# EAGLE design SNAC  7ch SMS DB9 3D in Housing with JST (EAGLE 9.0.1)
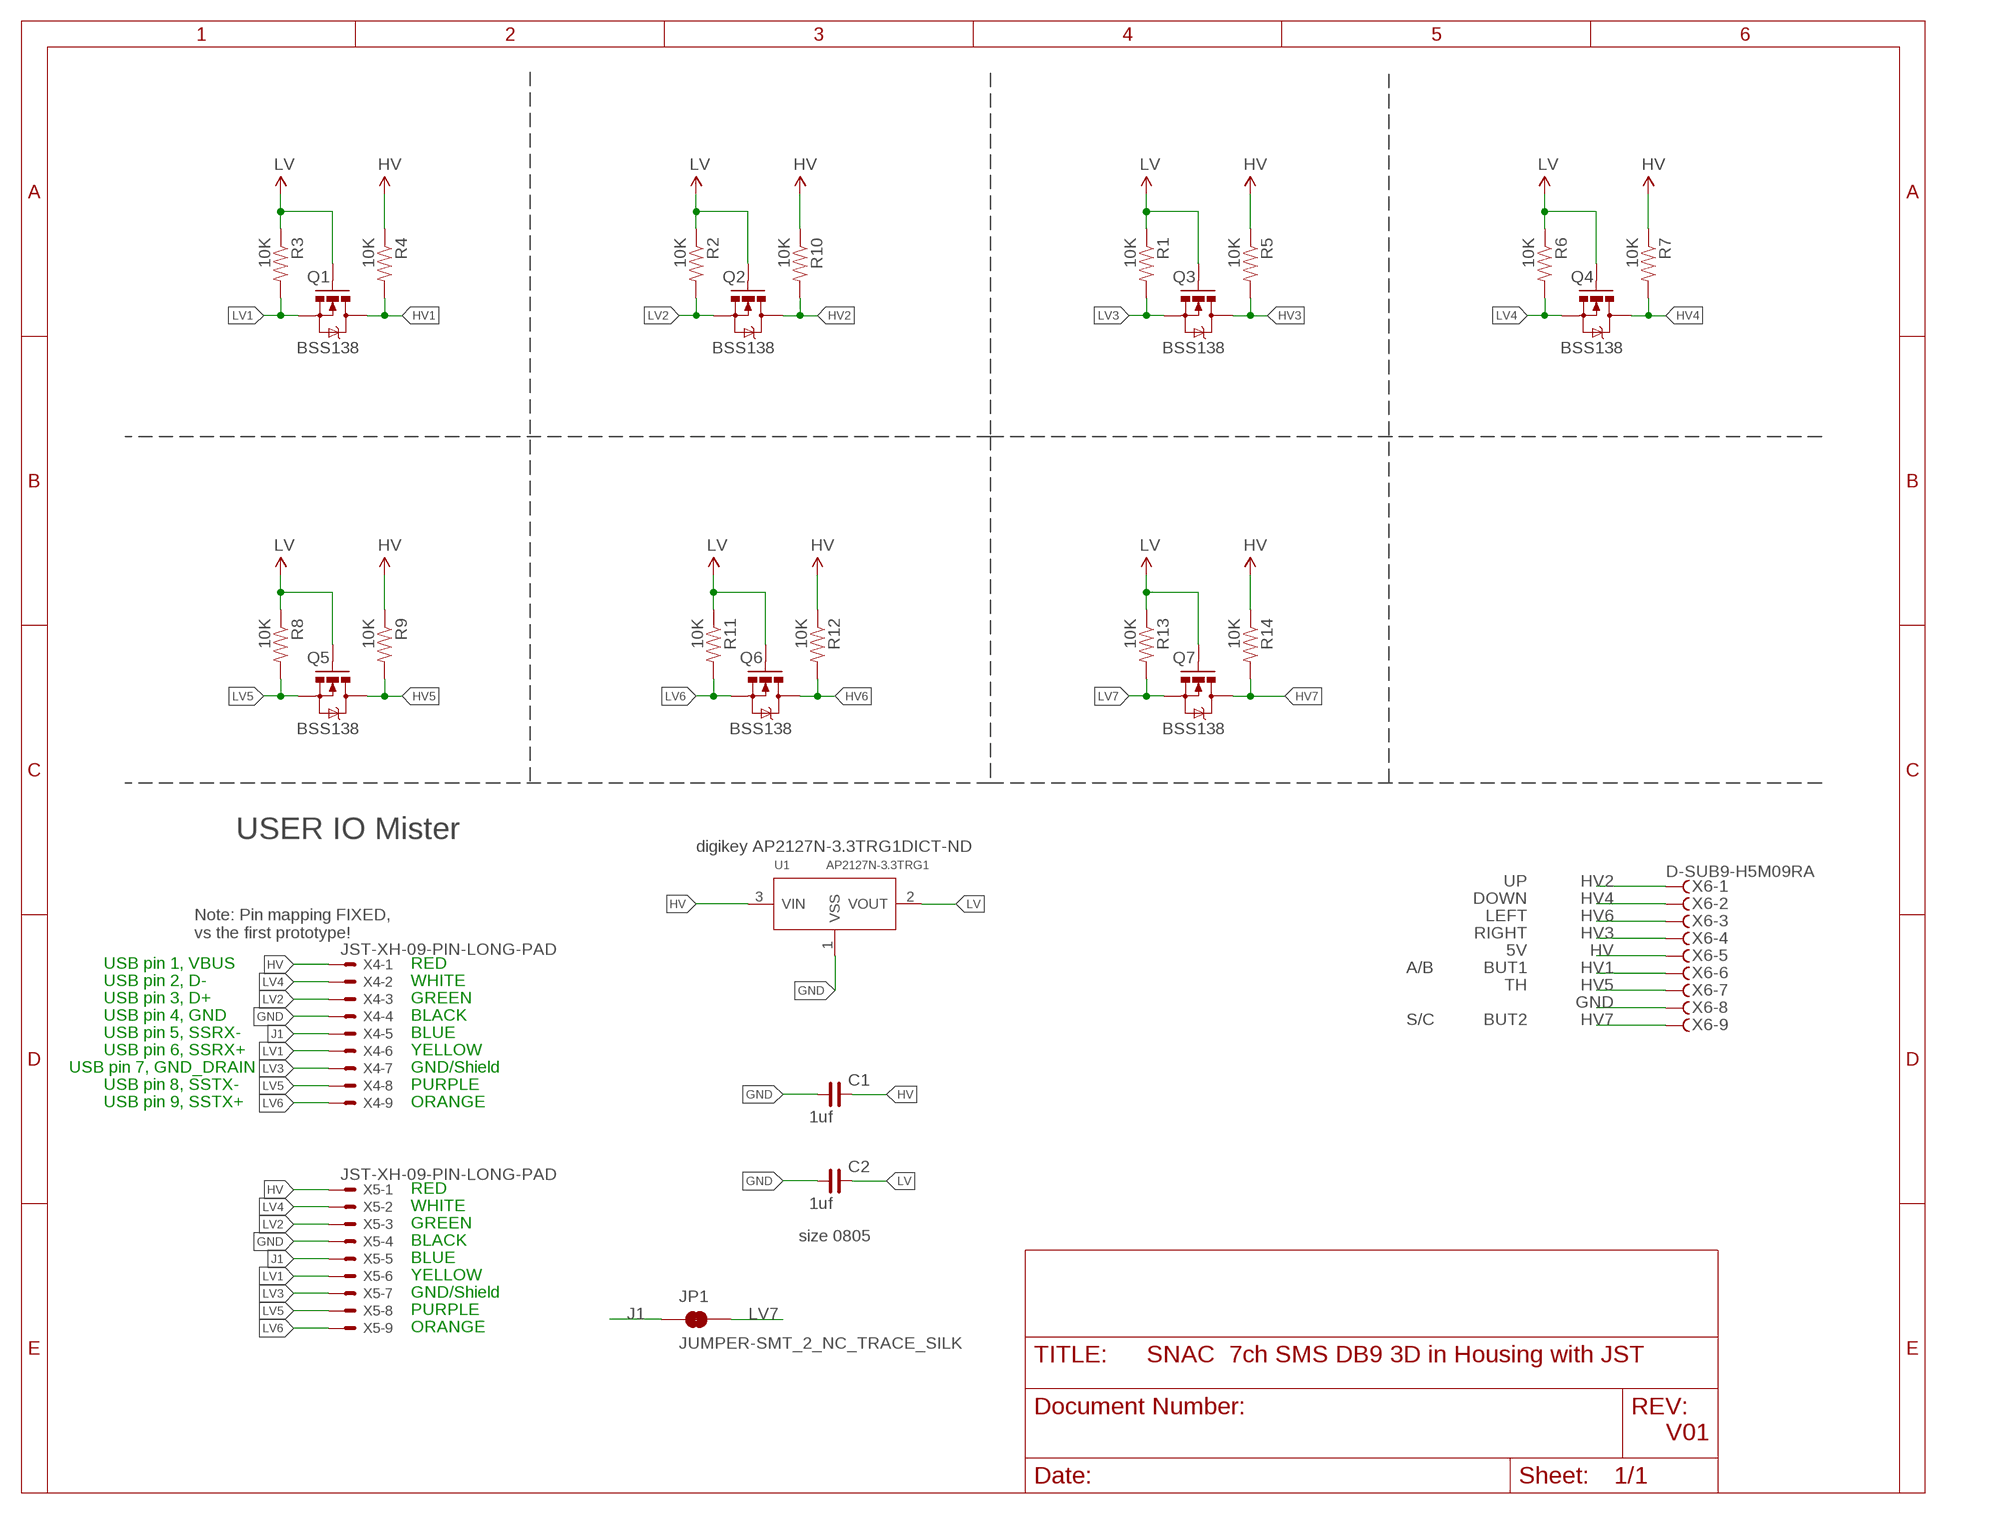
[diagram p0: schematic, sheet 1, part 1 of 2]
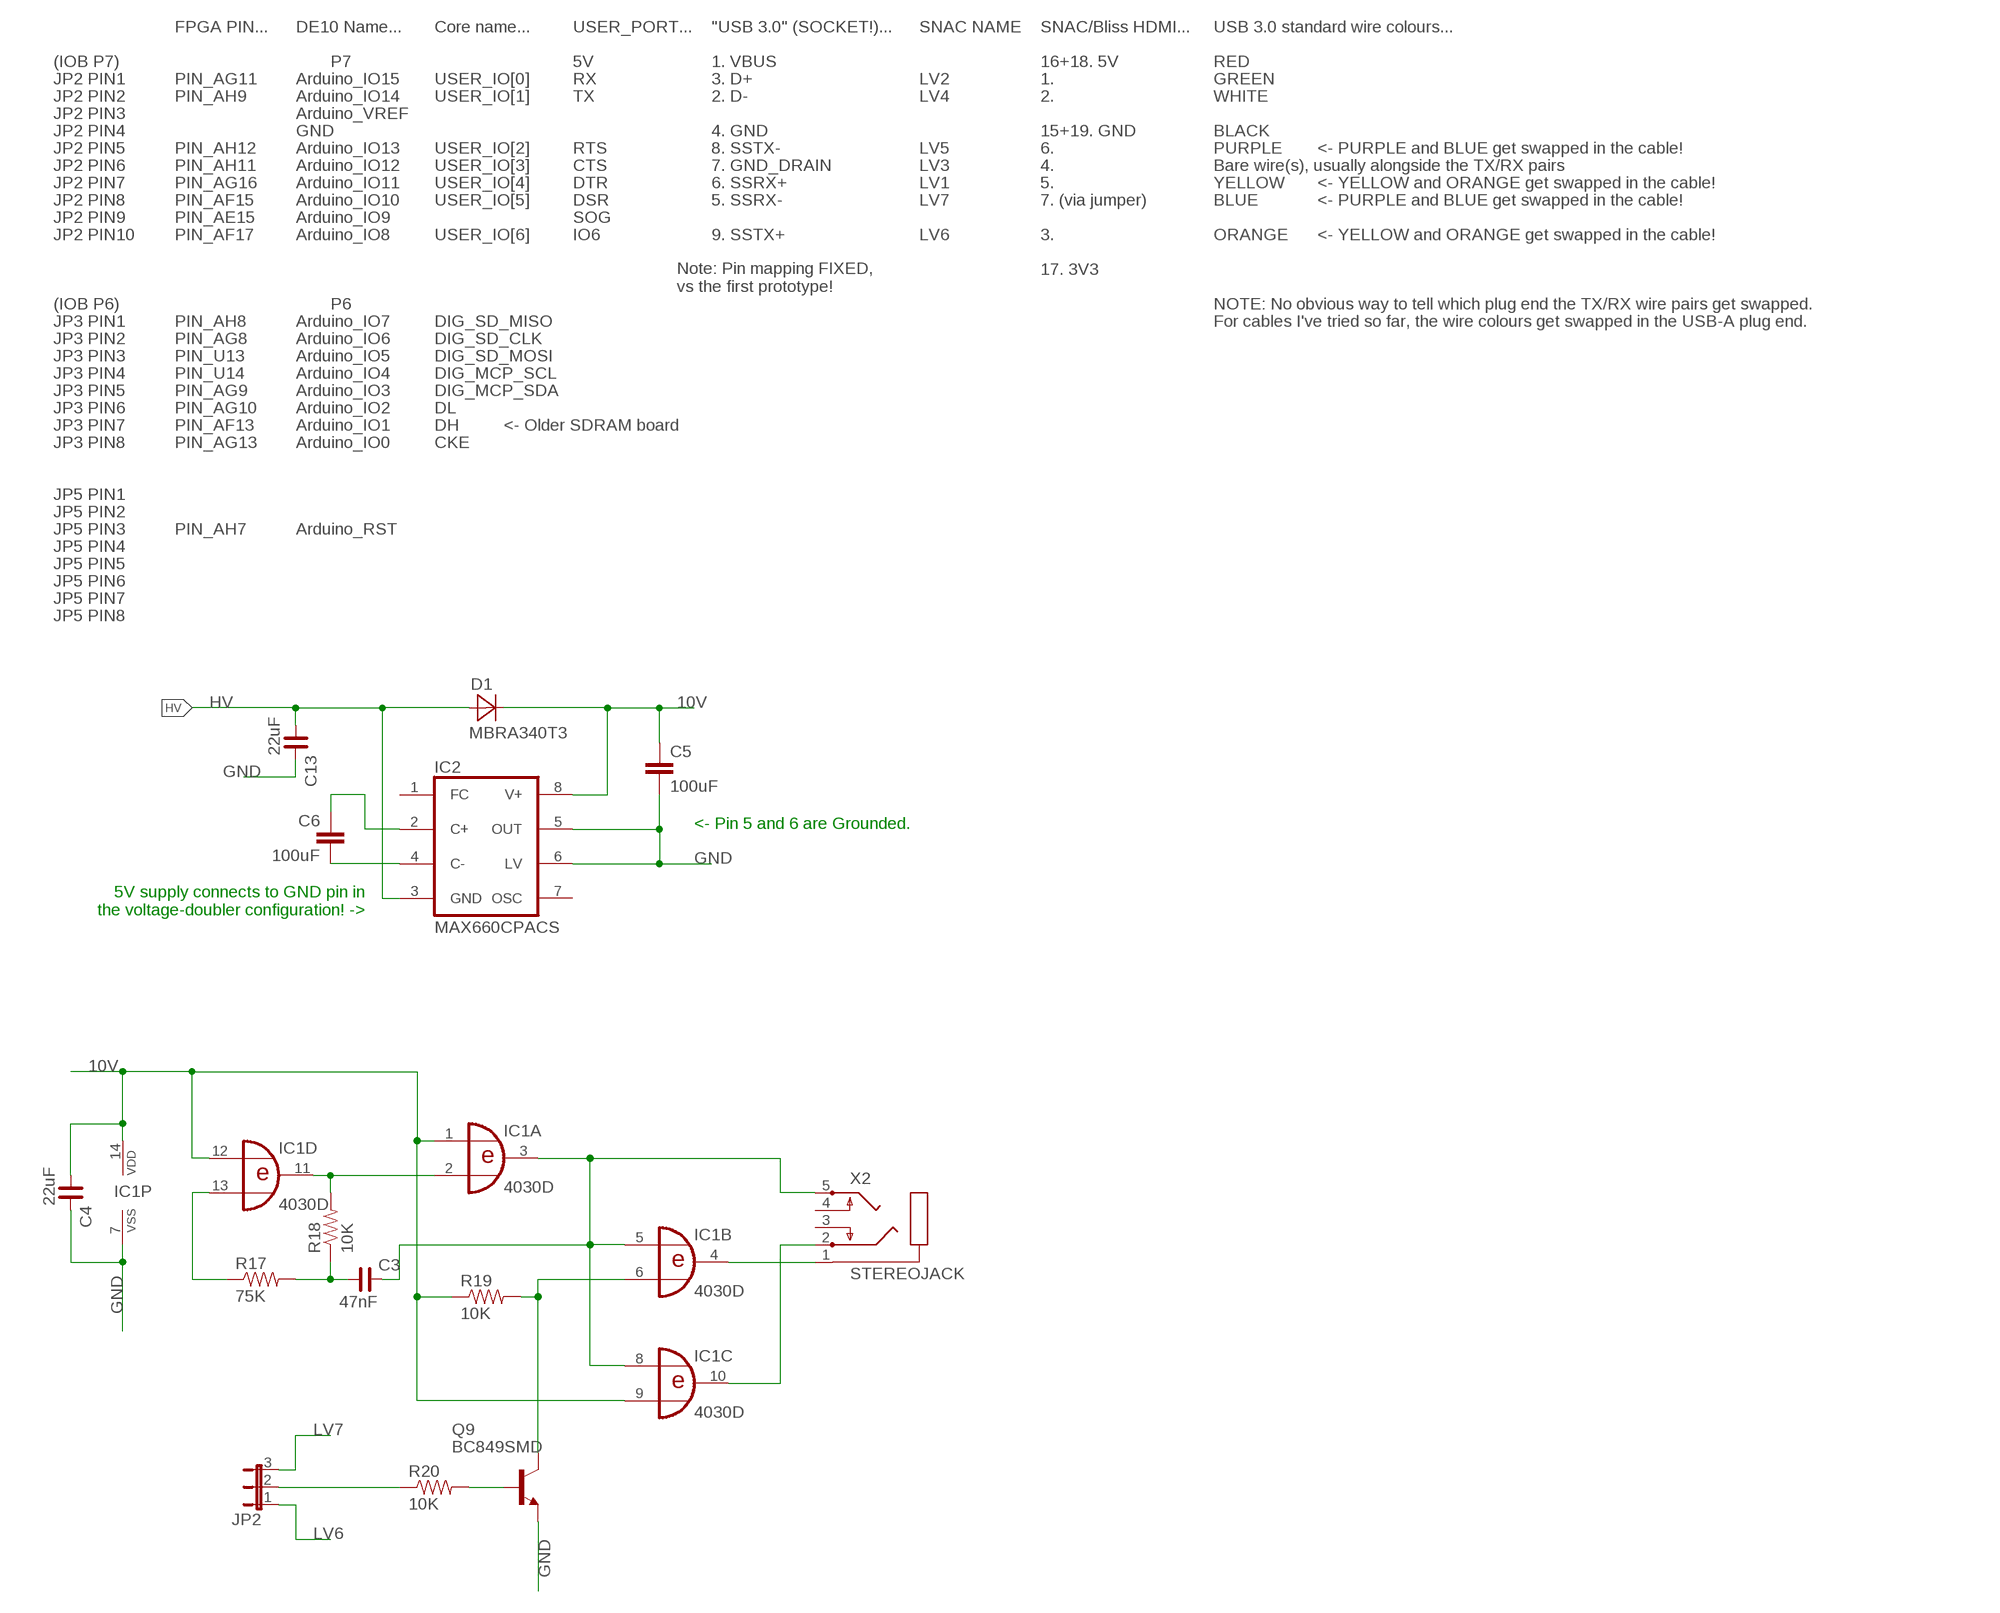
[diagram p1: schematic, sheet 1, part 2 of 2]

## Parts
C1  1uf  C_0805  [C0805]
C2  1uf  C_0805  [C0805]
C3  47nF  C_0805  [C0805]
C4  22uF  C_0805  [C0805]
C5  100uF  C-EUC1812  [C1812]
C6  100uF  C-EUC1812  [C1812]
C13  22uF  C_0805  [C0805]
D1  MBRA340T3  [SMA]
IC1  4030D  [SO14]
IC2  MAX660CPACS  [SO08]
JP1  JUMPER-SMT_2_NC_TRACE_SILK  [SMT-JUMPER_2_NC_TRACE_SILK]
JP2  JP2E  [JP2]
Q1  BSS138  MOSFET-NCHANNELSMD  [SOT23-3]
Q2  BSS138  MOSFET-NCHANNELSMD  [SOT23-3]
Q3  BSS138  MOSFET-NCHANNELSMD  [SOT23-3]
Q4  BSS138  MOSFET-NCHANNELSMD  [SOT23-3]
Q5  BSS138  MOSFET-NCHANNELSMD  [SOT23-3]
Q6  BSS138  MOSFET-NCHANNELSMD  [SOT23-3]
Q7  BSS138  MOSFET-NCHANNELSMD  [SOT23-3]
Q9  BC849SMD  [SOT23-BEC]
R1  10K  RESISTOR0603-RES  [0603-RES]
R2  10K  RESISTOR0603-RES  [0603-RES]
R3  10K  RESISTOR0603-RES  [0603-RES]
R4  10K  RESISTOR0603-RES  [0603-RES]
R5  10K  RESISTOR0603-RES  [0603-RES]
R6  10K  RESISTOR0603-RES  [0603-RES]
R7  10K  RESISTOR0603-RES  [0603-RES]
R8  10K  RESISTOR0603-RES  [0603-RES]
R9  10K  RESISTOR0603-RES  [0603-RES]
R10  10K  RESISTOR0603-RES  [0603-RES]
R11  10K  RESISTOR0603-RES  [0603-RES]
R12  10K  RESISTOR0603-RES  [0603-RES]
R13  10K  RESISTOR0603-RES  [0603-RES]
R14  10K  RESISTOR0603-RES  [0603-RES]
R17  75K  RESISTOR0603-RES  [0603-RES]
R18  10K  RESISTOR0603-RES  [0603-RES]
R19  10K  RESISTOR0603-RES  [0603-RES]
R20  10K  RESISTOR0603-RES  [0603-RES]
U1  AP2127N-3.3TRG1  PMIC-LDO-XC6206P332MR-G(SOT23)  [SOT-23]
X2  STEREOJACK  [STX3100]
X4  JST-XH-09-PIN-LONG-PAD  [JST-XH-09-PACKAGE-LONG-PAD]
X5  JST-XH-09-PIN-LONG-PAD  [JST-XH-09-PACKAGE-LONG-PAD]
X6  D-SUB9-H5M09RA  [H5M09RA]

## Nets
10V: C4.1 C5.1 D1.C IC1.1(A:I0) IC1.9(C:I1) IC1.12(D:I0) IC1.14(P:VDD) IC2.8(V+) R19.1
GND: C1.1 C2.1 C4.2 C5.2 C13.2 IC1.7(P:VSS) IC2.5(OUT) IC2.6(LV) Q9.E U1.1(VSS) X4.4 X5.4 X6.8
HV: C1.2 C13.1 D1.A IC2.3(GND) R4.1 R5.1 R7.1 R9.1 R10.1 R12.1 R14.1 U1.3(VIN) X4.1 X5.1 X6.5
HV1: Q1.3(D) R4.2 X6.6
HV2: Q2.3(D) R10.2 X6.1
HV3: Q3.3(D) R5.2 X6.4
HV4: Q4.3(D) R7.2 X6.2
HV5: Q5.3(D) R9.2 X6.7
HV6: Q6.3(D) R12.2 X6.3
HV7: Q7.3(D) R14.2 X6.9
J1: JP1.1 X4.5 X5.5
LV: C2.2 Q1.1(G) Q2.1(G) Q3.1(G) Q4.1(G) Q5.1(G) Q6.1(G) Q7.1(G) R1.1 R2.1 R3.1 R6.1 R8.1 R11.1 R13.1 U1.2(VOUT)
LV1: Q1.2(S) R3.2 X4.6 X5.6
LV2: Q2.2(S) R2.2 X4.3 X5.3
LV3: Q3.2(S) R1.2 X4.7 X5.7
LV4: Q4.2(S) R6.2 X4.2 X5.2
LV5: Q5.2(S) R8.2 X4.8 X5.8
LV6: JP2.1 Q6.2(S) R11.2 X4.9 X5.9
LV7: JP1.2 JP2.3 Q7.2(S) R13.2
N$5: IC1.2(A:I1) IC1.11(D:O) R18.2
N$6: C3.2 IC1.3(A:O) IC1.5(B:I0) IC1.8(C:I0) X2.5
N$7: IC1.4(B:O) X2.1
N$8: IC1.10(C:O) X2.2
N$9: IC1.13(D:I1) R17.1
N$10: C6.1 IC2.2(C+)
N$13: IC1.6(B:I1) Q9.C R19.2
N$14: Q9.B R20.2
N$23: C6.2 IC2.4(C-)
N$24: C3.1 R17.2 R18.1
N$27: JP2.2 R20.1
Unconnected: IC2.1(FC) IC2.7(OSC) X2.3 X2.4

## Notes on the sheet
- FPGA PIN... | DE10 Name... | Core name... | USER_PORT... | "USB 3.0" (SOCKET!)... | SNAC NAME | SNAC/Bliss HDMI... | USB 3.0 standard wire colours...
- (IOB P7) | P7 | 5V | 1. VBUS | 16+18. 5V | RED
- JP2 PIN1 | PIN_AG11 | Arduino_IO15 | USER_IO[0] | RX | 3. D+ | LV2 | 1. | GREEN
- JP2 PIN2 | PIN_AH9 | Arduino_IO14 | USER_IO[1] | TX | 2. D- | LV4 | 2. | WHITE
- JP2 PIN3 | Arduino_VREF
- JP2 PIN4 | GND | 4. GND | 15+19. GND | BLACK
- JP2 PIN5 | PIN_AH12 | Arduino_IO13 | USER_IO[2] | RTS | 8. SSTX- | LV5 | 6. | PURPLE | <- PURPLE and BLUE get swapped in the cable!
- JP2 PIN6 | PIN_AH11 | Arduino_IO12 | USER_IO[3] | CTS | 7. GND_DRAIN | LV3 | 4. | Bare wire(s), usually alongside the TX/RX pairs
- JP2 PIN7 | PIN_AG16 | Arduino_IO11 | USER_IO[4] | DTR | 6. SSRX+ | LV1 | 5. | YELLOW | <- YELLOW and ORANGE get swapped in the cable!
- JP2 PIN8 | PIN_AF15 | Arduino_IO10 | USER_IO[5] | DSR | 5. SSRX- | LV7 | 7. (via jumper) | BLUE | <- PURPLE and BLUE get swapped in the cable!
- JP2 PIN9 | PIN_AE15 | Arduino_IO9 | SOG
- JP2 PIN10 | PIN_AF17 | Arduino_IO8 | USER_IO[6] | IO6 | 9. SSTX+ | LV6 | 3. | ORANGE | <- YELLOW and ORANGE get swapped in the cable!
- 17. 3V3
- Note: Pin mapping FIXED,
  vs the first prototype!
- (IOB P6) | P6 | NOTE: No obvious way to tell which plug end the TX/RX wire pairs get swapped.
- JP3 PIN1 | PIN_AH8 | Arduino_IO7 | DIG_SD_MISO | For cables I've tried so far, the wire colours get swapped in the USB-A plug end.
- JP3 PIN2 | PIN_AG8 | Arduino_IO6 | DIG_SD_CLK
- JP3 PIN3 | PIN_U13 | Arduino_IO5 | DIG_SD_MOSI
- JP3 PIN4 | PIN_U14 | Arduino_IO4 | DIG_MCP_SCL
- JP3 PIN5 | PIN_AG9 | Arduino_IO3 | DIG_MCP_SDA
- JP3 PIN6 | PIN_AG10 | Arduino_IO2 | DL
- JP3 PIN7 | PIN_AF13 | Arduino_IO1 | DH | <- Older SDRAM board
- JP3 PIN8 | PIN_AG13 | Arduino_IO0 | CKE
- JP5 PIN1
- JP5 PIN2
- JP5 PIN3 | PIN_AH7 | Arduino_RST
- JP5 PIN4
- JP5 PIN5
- JP5 PIN6
- JP5 PIN7
- JP5 PIN8
- <- Pin 5 and 6 are Grounded.
- 5V supply connects to GND pin in
  the voltage-doubler configuration! ->
- USER IO Mister
- digikey AP2127N-3.3TRG1DICT-ND
- UP
- DOWN
- LEFT
- Note: Pin mapping FIXED,
  vs the first prototype!
- RIGHT
- 5V
- USB pin 1, VBUS | RED | A/B | BUT1
- USB pin 2, D- | WHITE | TH
- USB pin 3, D+ | GREEN
- USB pin 4, GND | BLACK | S/C | BUT2
- USB pin 5, SSRX- | BLUE
- USB pin 6, SSRX+ | YELLOW
- USB pin 7, GND_DRAIN | GND/Shield
- USB pin 8, SSTX- | PURPLE
- USB pin 9, SSTX+ | ORANGE
- RED
- WHITE
- GREEN
- BLACK | size 0805
- BLUE
- YELLOW
- GND/Shield
- PURPLE
- ORANGE
- V01

## Library data of the parts
C1-C4 C13 = rc-master-smd:C_: NON-POLARIZED CAP
C5 C6 = rcl:C-EU: CAPACITOR, European symbol; SPICEPREFIX: C
D1 = diode:MBRA340T3: Surface Mount Schottky Power Rectifier Source: http://www.onsemi.com/pub_link/Collateral/MBRA340T3-D.PDF
IC1 = 40xx:4030: Quad XOR
IC2 = maxim:MAX660CPA: Charge-pump VOLTAGE CONVERTER
JP1 = SparkFun-Jumpers:JUMPER-SMT_2_NC_TRACE: Normally closed trace jumper This jumper has a trace between two pads so it's normally closed (NC). Use a razor knife to open the connection. For best results follow the IPC guidelines for cutting traces: Cutout at least 0.063 mm (0.005 in). Remove all loose material to clean up the cut area. Seal the cut with an approved epoxy. Reapply solder to reclose the connection.
JP2 = jumper:JP2E: JUMPER
Q1-Q7 = SparkFun:MOSFET-NCHANNEL
Q9 = transistor-npn:BC849*: NPN Transistor
R1-R14 R17-R20 = SparkFun:RESISTOR: Resistor Basic schematic elements and footprints for 0603, 1206, and PTH 1/10th watt (small) resistors.
U1 = PMIC-LDO-XC6206P332MR-G_SOT23_:PMIC-LDO-XC6206P332MR-G(SOT23): 310030099; AVAILABILITY: Unavailable; DESCRIPTION: SMD PMIC; LDO; Vin 6V; 3.3V; 200mA; Without En; 1-Ch; MF: Torex; MP: XC6206P332MR-G; PACKAGE: SOT-23-3 Torex; PRICE: None
X2 = adafruit:STEREOJACK: MIC/HEADPHONE JACK Stereo jack with two switches. Kycon STX3100, CUI SJ1-3555NG and/or 4UCon 05544
X4 X5 = Rembrandt Electronics - JST XH Connectors v1-0:JST-XH-09-PIN: JST XH Connector 2 Pin Wire to board connector. Pitch: 2,54 mm, (0.100") Number of pins: 9 Created by Rembrandt Electronics www.rembrandtelectronics.com
X6 = con-thomas-betts:D-SUB9-: D-Subminiatur Connector Source: Electronioc Interconnects European Edition 1998; OC_FARNELL: unknown; OC_NEWARK: unknown

## Board
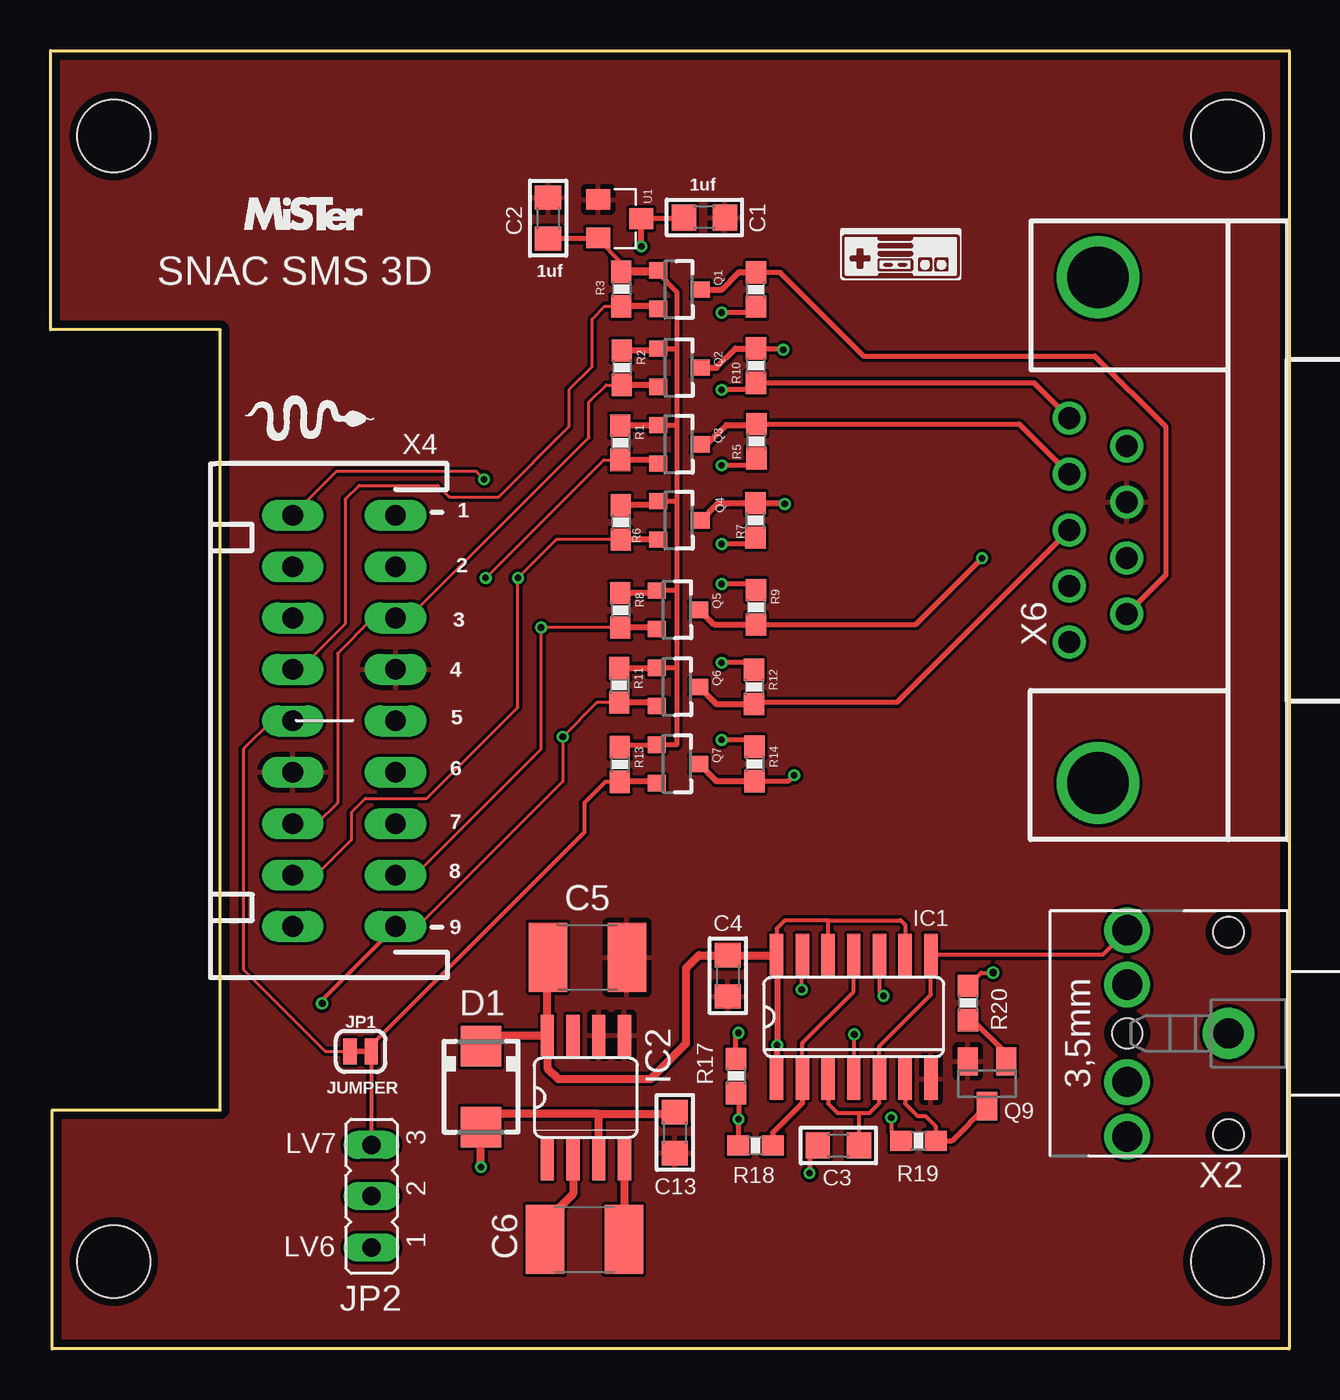
[diagram p2: board, top side]
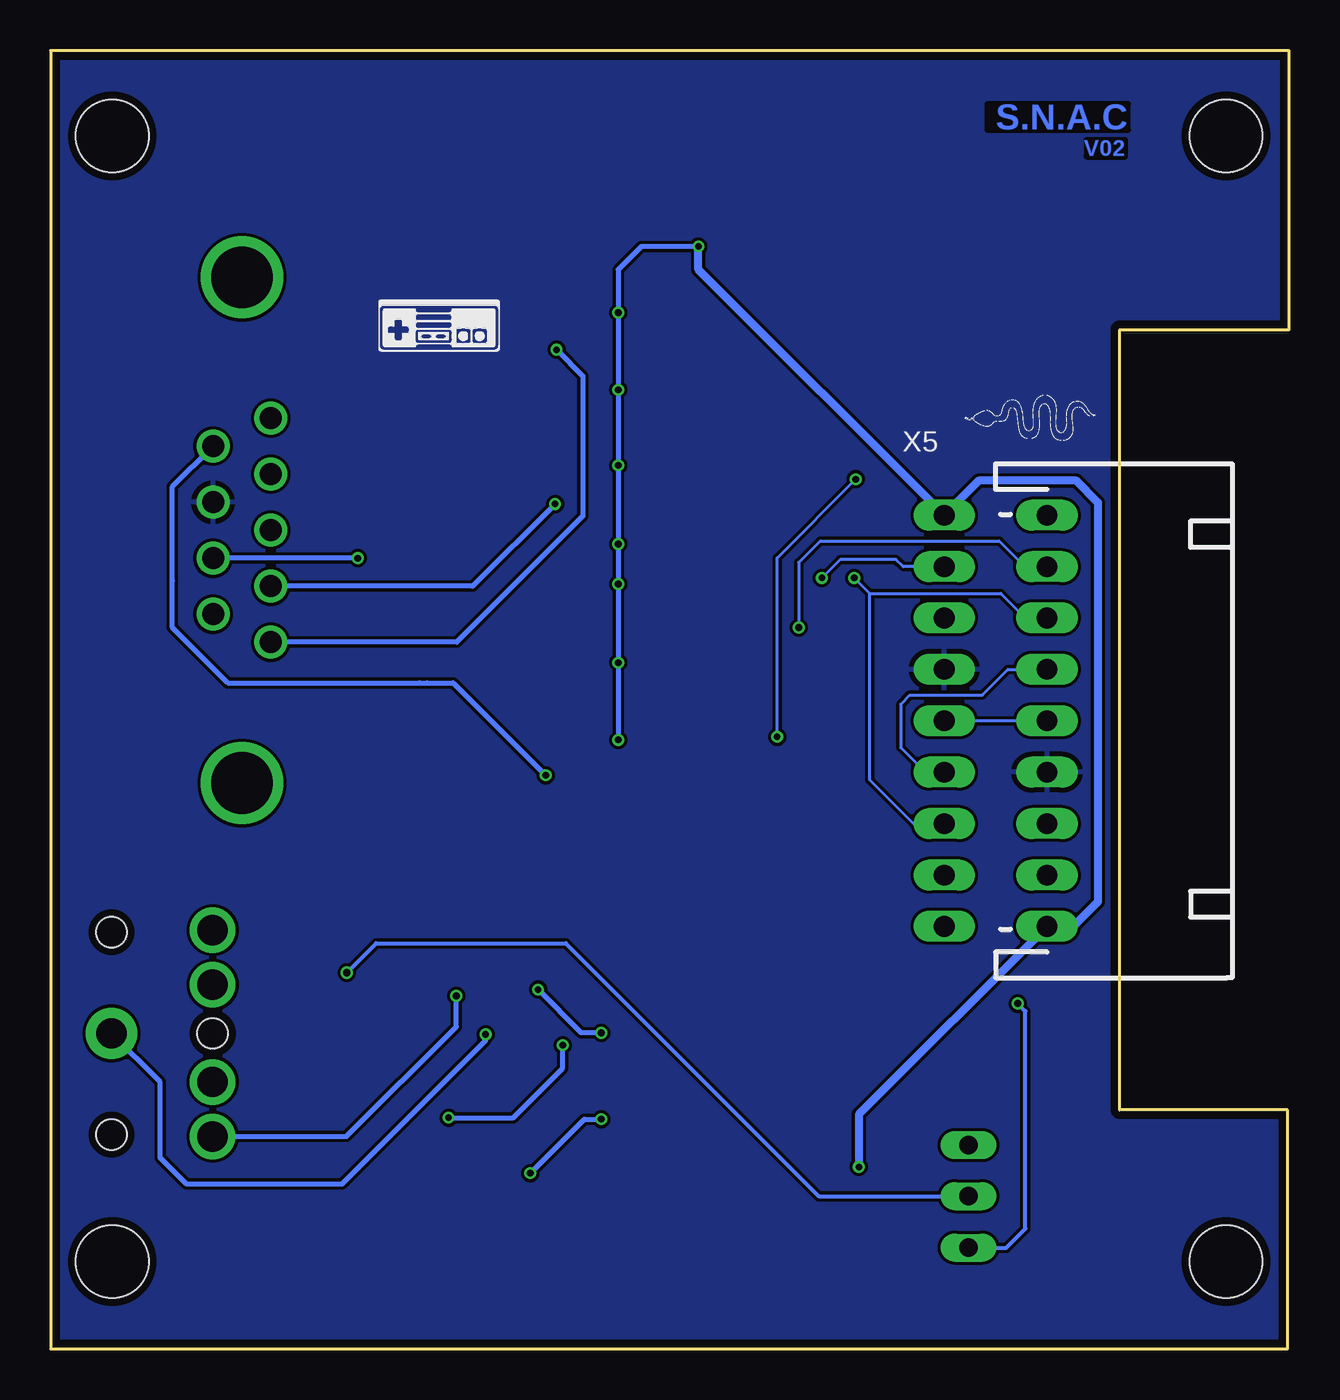
[diagram p3: board, bottom side, seen from below]

Size 61.19 x 64.16 mm. Coordinates in mm from the lower left corner, seen from the top.
Outline: 0,64.16 61.19,64.16 61.19,0 0.08,0 0.08,11.81 8.38,11.81 8.38,50.37 0,50.37 0,64.16
Copper layers (1*16): Top 0.035559375mm / dielectric 1.6mm / Bottom 0.035559375mm
Design rules "oshpark-2layer *": minimum track width 5mil, minimum drill 10mil, track to track 6mil, track to pad 6mil, pad to pad 6mil, via to via 6mil, smd to smd 6mil, copper to edge 15mil, drill to drill 6mil, minimum pad ring 5mil, minimum via ring 5mil, stop-mask expansion 2.5mil, vias tented up to drill 0mil, thermal gap 10mil
Holes 3.6 mm at 3.12,59.94 58.14,59.94 3.12,4.32 58.14,4.32

### Footprints (pad centres in the part's own frame; a part is rotated, then mirrored left to right if it is on the bottom)
C0805 = smd 1.2 x 1.3: 1 -1.016,0; 2 1.016,0
C1812 = smd 1.9 x 3.4: 1 -1.95,0; 2 1.95,0
SMA = smd 2 x 2: A 2,0; C -2,0
SO14 = smd 0.66 x 2.032: 1 -3.81,-3.073; 2 -2.54,-3.073; 3 -1.27,-3.073; 4 0,-3.073; 5 1.27,-3.073; 6 2.54,-3.073; 7 3.81,-3.073; 8 3.81,3.073; 9 2.54,3.073; 10 1.27,3.073; 11 0,3.073; 12 -1.27,3.073; 13 -2.54,3.073; 14 -3.81,3.073
SO08 = smd 0.66 x 2.032: 1 -1.905,-3.073; 2 -0.635,-3.073; 3 0.635,-3.073; 4 1.905,-3.073; 5 1.905,3.073; 6 0.635,3.073; 7 -0.635,3.073; 8 -1.905,3.073
SMT-JUMPER_2_NC_TRACE_SILK = smd 0.66 x 1.27: 1 -0.521,0; 2 0.521,0
JP2 = drill 0.914 long: 1 -2.54,0; 2 0,0; 3 2.54,0
SOT23-3 = smd 0.8 x 0.9: 1 -0.95,-1; 2 0.95,-1; 3 0,1.1
SOT23-BEC = smd 1 x 1.4: B -0.95,-1.1; C 0,1.1; E 0.95,-1.1
0603-RES = smd 1.1 x 1: 1 -0.85,0; 2 0.85,0
SOT-23 = smd 1.016 x 1.2: 1 -0.95,-1.06; 2 0.95,-1.06; 3 0,1.06
STX3100 = drill 1.5 pad 2.54: 1 2.7,-0.1 | drill 1.5: 2 7.7,5; 3 7.7,2.3; 4 7.7,-2.5; 5 7.7,-5.2 | hole 1.5: 2.7,4.9; 2.7,-5.1; 7.7,-0.1
JST-XH-09-PACKAGE-LONG-PAD = drill 1.016 long: 1 10.16,0; 2 7.62,0; 3 5.08,0; 4 2.54,0; 5 0,0; 6 -2.54,0; 7 -5.08,0; 8 -7.62,0; 9 -10.16,0
H5M09RA = drill 1.092: 1 -5.537,1.422; 2 -2.769,1.422; 3 0,1.422; 4 2.769,1.422; 5 5.537,1.422; 6 -4.153,-1.422; 7 -1.384,-1.422; 8 1.384,-1.422; 9 4.153,-1.422 | drill 3.048: GND@1 -12.497,0; GND@2 12.497,0

### Placement (x,y rotation side)
C1  32.3,55.91 180 top
C2  24.57,55.88 270 top
C3  38.91,10.06 0 top
C4  33.45,18.44 270 top
C5  26.52,19.35 0 top
C6  26.37,5.41 0 top
C13  30.84,10.69 270 top
D1  21.26,12.95 270 top
IC1  39.67,16.41 0 top
IC2  26.44,12.42 0 top
JP1  15.32,14.71 0 top
JP2  15.85,7.54 90 top
Q1  31.01,52.35 270 top
Q2  31.01,48.49 270 top
Q3  31.01,44.7 270 top
Q4  31.01,40.94 270 top
Q5  30.94,36.53 270 top
Q6  30.94,32.72 270 top
Q7  30.94,28.91 270 top
Q9  46.25,13.11 180 top
R1  28.14,44.78 270 top
R2  28.22,48.49 270 top
R3  28.19,52.37 270 top
R4  34.84,52.35 90 top
R5  34.87,44.86 90 top
R6  28.17,40.84 270 top
R7  34.82,40.94 90 top
R8  28.14,36.5 270 top
R9  34.85,36.65 270 top
R10  34.85,48.59 90 top
R11  28.09,32.79 270 top
R12  34.75,32.72 270 top
R13  28.12,28.88 270 top
R14  34.77,28.91 270 top
R17  33.86,13.49 270 top
R18  34.82,10.06 0 top
R19  42.88,10.29 0 top
R20  45.31,17.09 270 top
U1  28.12,55.85 270 top
X2  60.88,15.49 180 top
X4  17.04,31.04 90 top
X5  11.96,31.04 270 bottom
X6  51.74,40.46 90 top

### Tracks (layer width: path | path; a pad name or v marks a point on that pad's centre or on a via)
10V  (via drill 0.33)
  Top 0.2: 38.41,21.18 36.27,21.18 35.87,20.78 IC1.14
  Top 0.203: v41.53,11.43 41.53,10.78 R19.1 | IC1.9 42.22,20.95 41.99,21.18 38.41,21.18 IC1.12
  Top 0.305: IC1.1 35.89,13.36 v35.89,15.01 35.89,19.46 IC1.14
  Top 0.406: D1.C 21.8,15.49 IC2.8 | IC2.8 24.54,19.32 C5.1 | IC2.8 24.54,13.87 25.07,13.33 29.64,13.33 31.39,15.09 31.39,18.82 32.03,19.46 C4.1 | C4.1 33.48,19.48 | C4.1 35.84,19.46 IC1.14
  Bottom 0.254: v41.53,11.43 38.33,11.43 35.89,13.87 v35.89,15.01
GND
  pour Top: 0,64.16 61.19,64.16 61.19,0 0.08,0 0.08,11.81 8.38,11.81 8.38,50.37 0,50.37
  pour Bottom: 0,64.16 61.19,64.16 61.19,0 0.08,0 0.08,11.81 8.38,11.81 8.38,50.37 0,50.37
HV  (via drill 0.33)
  Top 0.254: 31.24,55.87 C1.2 | C1.2 31.23,55.85 U1.3 | 31.26,55.89 C1.2 | X6.5 48.58,47.74 R10.1 34.51,47.4 v33.15,47.4 | R14.1 34.43,30.1 v33.15,30.1 | R12.1 34.4,33.91 v33.15,33.91 | R9.1 34.56,37.8 v33.15,37.8 | 34.85,40.07 34.56,39.78 v33.15,39.78 | R5.1 34.53,43.66 v33.15,43.66 | R4.1 34.55,51.21 v33.15,51.21
  Top 0.305: R7.1 34.85,40.07 | v29.18,54.48 29.18,55.85 U1.3
  Top 0.406: IC2.3 27.08,11.61 | 27.08,11.61 30.73,11.61 C13.1 | v21.26,8.99 D1.A 22.14,11.61 27.08,11.61
  Bottom 0.254: v29.18,54.48 32,54.48 33.15,53.34 v33.15,51.21 v33.15,47.4 v33.15,43.66 v33.15,39.78 v33.15,37.8 v33.15,33.91 v33.15,30.1
  Bottom 0.406: v29.18,54.48 29.18,53.34 X4.1 15.34,42.9 10.52,42.9 9.45,41.83 9.45,22.1 10.67,20.88 X5.1 21.26,11.58 v21.26,8.99
HV1
  Top 0.178: 34.93,53.29 R4.2
  Top 0.254: R4.2 36.03,53.2 40.16,49.07 51.59,49.07 55.09,45.57 55.09,38.24 X6.6
  Top 0.305: Q1.3 33.15,52.35 34,53.2 R4.2
HV2  (via drill 0.33)
  Top 0.178: 34.84,49.43 R10.2
  Top 0.254: R10.2 36.13,49.44 v36.2,49.38
  Top 0.305: Q2.3 32.89,48.49 33.84,49.44 R10.2
  Bottom 0.254: v36.2,49.38 34.9,48.08 34.9,47.78 34.9,44.27 34.9,44.04 34.9,41.15 41.12,34.92 X6.1
HV3
  Top 0.178: Q3.3 32.44,44.7 | R5.2 34.92,45.66
  Top 0.254: R5.2 47.84,45.71 X6.4
  Top 0.305: 32.44,44.7 33.39,45.66 34.92,45.66
HV4  (via drill 0.33)
  Top 0.305: Q4.3 32.96,41.8 R7.2 36.23,41.8 v36.27,41.76
  Bottom 0.254: v36.27,41.76 40.34,37.69 X6.2
HV5  (via drill 0.33)
  Top 0.254: R9.2 42.74,35.8 v46.01,39.08
  Top 0.305: Q5.3 32.76,35.8 R9.2
  Bottom 0.254: v46.01,39.08 X6.7
HV6
  Top 0.178: R12.2 34.84,31.95
  Top 0.254: 34.84,31.95 41.81,31.95 X6.3
  Top 0.305: Q6.3 32.89,31.87 R12.2
HV7  (via drill 0.33)
  Top 0.178: 34.86,28.14 R14.2
  Top 0.254: R14.2 36.44,28.05 v36.73,28.35
  Top 0.305: Q7.3 32.89,28.05 R14.2
  Bottom 0.254: v36.73,28.35 41.3,32.92 42.6,32.92 42.98,32.92 52.43,32.92 55.17,35.66 55.17,37.95 55.17,42.61 X6.9
J1
  Top 0.152: X5.5 10.92,31.04 9.53,29.64 9.53,18.75 13.56,14.71 JP1.1
  Bottom 0.152: X5.5 X4.5
LV
  Top 0.178: 30.11,41.8 Q4.1 | 30.01,49.51 Q2.1 29.89,49.31 29.86,49.34 | Q4.1 | 29.84,33.56 Q6.1 29.91,33.64 | Q4.1 29.92,41.99 29.63,41.69 | 30,37.41 Q5.1 29.81,37.35 | Q3.1 29.91,45.55 29.84,45.63 | Q1.1 29.94,53.23 | 28.65,37.35 R8.1
  Top 0.203: R3.1 28.19,53.69 27.02,54.86
  Top 0.254: U1.2 27.02,54.86 C2.2 | 29.94,53.23 30.94,52.23 30.94,49.45 | 30.94,49.45 30.94,45.64 | 30.94,45.64 30.94,41.91 | 30.94,41.91 30.94,37.49 | 30.94,37.49 30.94,33.68 | 30.94,33.68 30.94,29.87 30.92,29.86 Q7.1 28.24,29.86 R13.1 | Q2.1 30.92,49.44 30.94,49.45 | Q3.1 30.02,45.64 30.94,45.64 | Q4.1 30.03,41.91 30.94,41.91 | Q5.1 29.95,37.49 30.94,37.49 | Q6.1 29.95,33.68 30.94,33.68
  Top 0.305: 29.86,49.34 R2.1 | 29.84,45.63 R1.1 | 29.63,41.69 R6.1 | 29.81,37.35 28.65,37.35 | R11.1 29.91,33.64
  Top 0.406: 29.94,53.23 R3.1
LV1
  Top 0.152: R3.2 27.37,51.52 26.75,50.9 26.75,48.54 25.6,47.4 25.6,45.57 22.14,42.1 19.7,42.1 19.13,42.67 15.24,42.67 14.55,41.99 14.55,35.81 12.32,33.58 X5.6
  Top 0.178: Q1.2 29.89,51.52
  Top 0.305: 29.89,51.52 R3.2
  Bottom 0.152: X4.6 17.98,28.5 19.2,29.72 19.2,31.85 18.75,32.31 15.16,32.31 13.89,33.58 X5.6
LV2
  Top 0.152: R2.2 27.45,47.64 26.59,46.79 26.59,45.03 17.68,36.12 X4.3 15.93,36.12 14.17,34.37 14.17,26.97 13.16,25.96 X5.3
  Top 0.178: Q2.2 29.91,47.64
  Top 0.305: 29.91,47.64 R2.2
LV3  (via drill 0.33)
  Top 0.152: R1.2 27.32,43.93 v21.49,38.1
  Top 0.178: Q3.2 29.84,43.93
  Top 0.305: 29.84,43.93 R1.2
  Bottom 0.152: X4.7 18.57,25.96 20.73,28.12 20.73,37.34 | 20.73,37.34 14.25,37.34 13.03,36.12 X5.7 | 20.73,37.34 v21.49,38.1
LV4  (via drill 0.33)
  Top 0.152: 28.1,39.99 24.98,39.99 v23.09,38.1 23.09,31.7 18.59,27.2 15.55,27.2 14.86,26.52 14.86,25.15 13.13,23.42 X5.2
  Top 0.178: Q4.2 29.99,40.02 29.96,39.99 | R6.2 28.1,39.99
  Top 0.305: 29.96,39.99 R6.2
  Bottom 0.152: X4.2 19.08,38.66 19.43,39.01 22.17,39.01 v23.09,38.1
LV5  (via drill 0.33)
  Top 0.152: R8.2 v24.23,35.65 24.23,29.64 18.01,23.42 X4.8
  Top 0.178: Q5.2 29.86,35.65 | R8.2 28,35.51
  Top 0.305: 29.86,35.65 R8.2
  Bottom 0.152: v24.23,35.65 24.23,38.86 23.17,39.93 14.33,39.93 13.06,38.66 X5.8
LV6  (via drill 0.33, 0.35)
  Top 0.152: R11.2 26.99,31.94 v25.3,30.25 25.3,28.04 18.14,20.88 X4.9 | v21.41,42.98 21.03,43.36 14.12,43.36 X5.9
  Top 0.178: Q6.2 29.75,31.95 29.74,31.94
  Top 0.203: v13.41,17.07 13.41,17.25 X4.9
  Top 0.305: 29.74,31.94 R11.2
  Bottom 0.152: v25.3,30.25 25.3,39.09 v21.41,42.98
  Bottom 0.203: JP2.1 13.97,5 13.03,5.94 13.03,16.69 v13.41,17.07
LV7
  Top 0.178: Q7.2 29.86,28.03
  Top 0.203: R13.2 27.42,28.03 26.37,26.97 26.37,25.53 15.82,14.99 15.82,14.72 JP1.2 15.84,10.1 JP2.3
  Top 0.305: 29.86,28.03 R13.2
N$5
  Top 0.203: IC1.11 39.68,17.65 37.14,15.11 IC1.2
  Top 0.254: IC1.2 37.14,12.14 35.67,10.68 R18.2
N$6
  Top 0.203: IC1.3 38.41,12.12 38.86,11.66 39.93,11.66 | 39.93,11.66 40.46,11.66 40.95,12.14 IC1.5 40.95,14.96 43.49,17.5 IC1.8 51.97,19.48 X2.5 | 39.93,11.66 C3.2
N$7  (via drill 0.33)
  Top 0.203: v39.7,15.54 39.68,15.52 IC1.4
  Bottom 0.254: X2.1 55.78,13.19 55.78,9.45 54.48,8.15 46.79,8.15 39.7,15.24 v39.7,15.54
N$8  (via drill 0.33)
  Top 0.203: IC1.10 40.95,17.65 v41.15,17.45
  Bottom 0.254: X2.2 46.58,10.49 41.15,15.93 v41.15,17.45
N$9  (via drill 0.33)
  Top 0.203: v37.11,17.75 37.11,19.46 IC1.13
  Top 0.254: R17.1 33.86,15.49 v33.99,15.62
  Bottom 0.254: v33.99,15.62 34.98,15.62 v37.11,17.75
N$10
  Top 0.406: IC2.2 25.81,7.67 24.42,6.28 C6.1
N$13
  Top 0.203: 42.22,12.42 IC1.6 42.22,12.12 42.82,11.51 43.21,11.51 43.73,10.99 R19.2
  Top 0.254: R19.2 44.53,10.29 Q9.C
N$14
  Top 0.254: Q9.B 47.2,14.59 45.55,16.24 R20.2
N$23
  Top 0.406: IC2.4 28.35,5.44 C6.2
N$24  (via drill 0.33)
  Top 0.254: C3.1 37.49,9.65 v37.49,8.69 | R18.1 33.97,11.34 v33.99,11.35 33.99,12.51 R17.2
  Bottom 0.254: v37.49,8.69 34.82,11.35 v33.99,11.35
N$27  (via drill 0.35)
  Top 0.203: R20.1 45.96,18.59 v46.56,18.59
  Bottom 0.203: v46.56,18.59 45.11,20.04 35.74,20.04 23.24,7.54 JP2.2

### Text on the board
Bottom: S.N.A.C | V02
tPlace: 1uf | 1uf | SNAC SMS 3D | 1 | 2 | 3 | 4 | 5 | 6 | 7 | 8 | 9 | JUMPER | LV7 | LV6